# Altium schematic sheet ESC.SchDoc
size A3; PageSetup: Record=PageOptions|CenterHorizontal=True|CenterVertical=True|PrintScale=0.34|XCorrection=1.00|YCorrection=1.00|PrintKind=1|BorderSize=5000000|LeftOffset=0|BottomOffset=0|Orientation=2|PaperLength=1000|PaperWidth=1000|Scale=100|PaperSource=7|PrintQuality=-3|MediaType=1|DitherType=10|PrintScaleMode=1|PaperKind=A3|PaperIndex=8
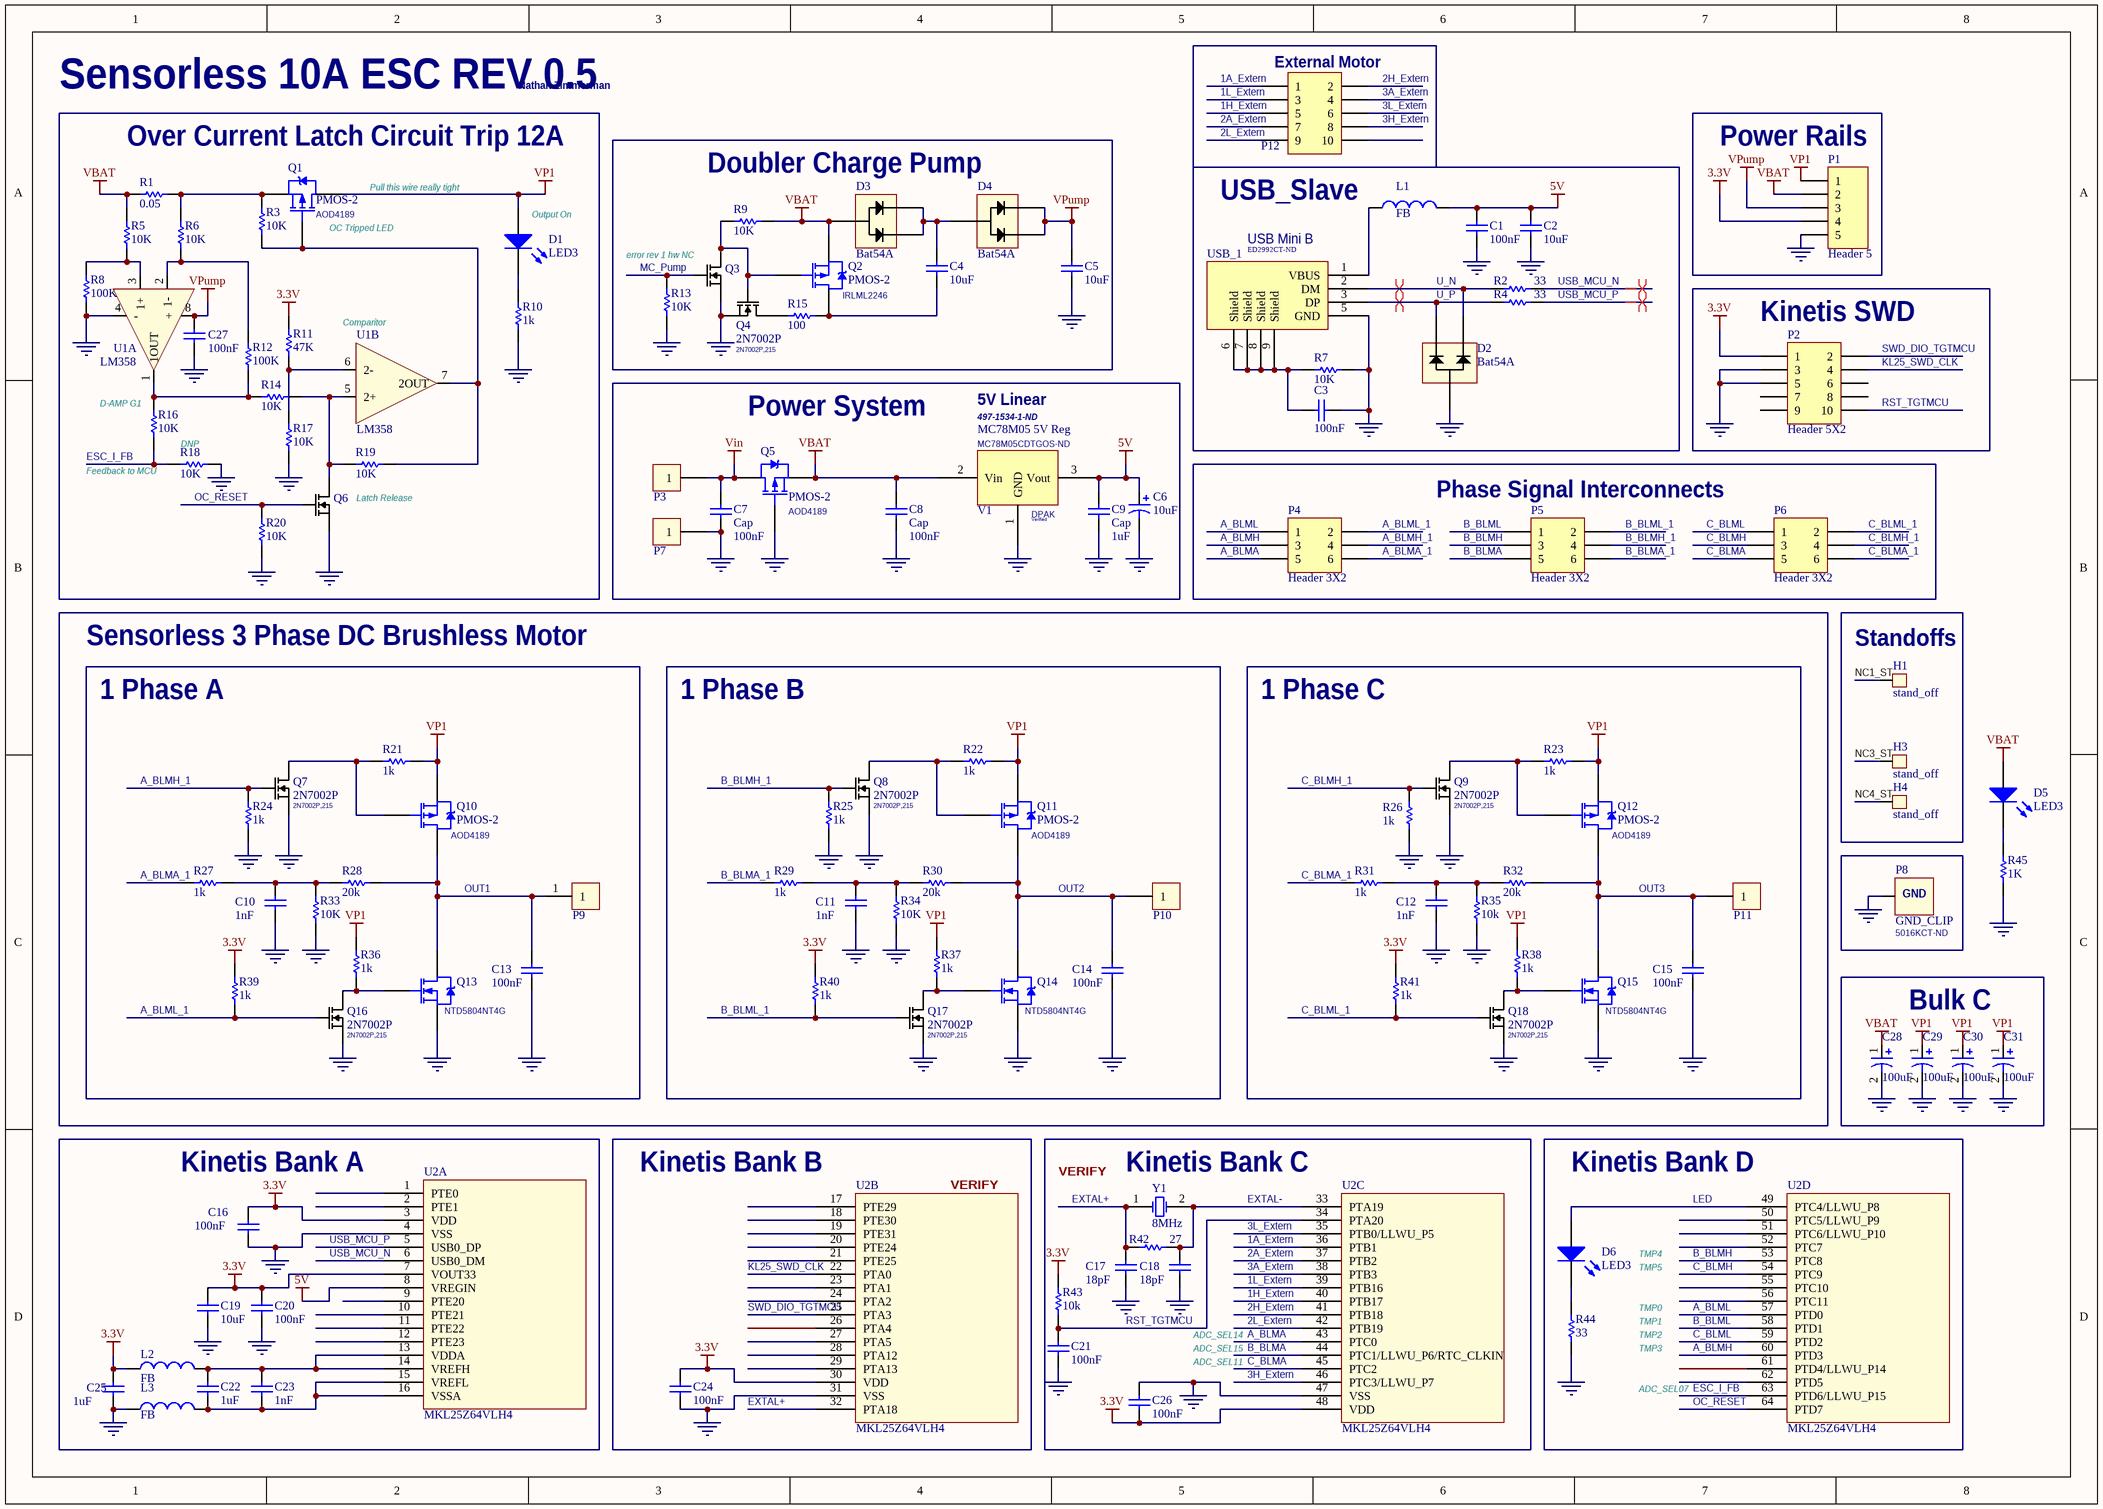
[diagram p0: ESC.SchDoc]

## Parts
C1  value 100nF  [1608[0603]]  (hidden comment: 0805)
C2  value 10uF  [C0805]  (hidden comment: 0805)
C3  value 100nF  [1608[0603]]  (hidden comment: 0805)
C4  value 10uF  [C0805]  (hidden comment: 0805)
C5  value 10uF  [C0805]  (hidden comment: 0805)
C6  value 10uF  [1206_C]  (hidden comment: Cap Pol1)
C7  Cap  value 100nF  [C0805]
C8  Cap  value 100nF  [C0805]
C9  Cap  value 1uF  [C0805]
C10  value 1nF  [1608[0603]]  (hidden comment: 0805)
C11  value 1nF  [1608[0603]]  (hidden comment: 0805)
C12  value 1nF  [1608[0603]]  (hidden comment: 0805)
C13  value 100nF  [1608[0603]]  (hidden comment: 0805)
C14  value 100nF  [1608[0603]]  (hidden comment: 0805)
C15  value 100nF  [1608[0603]]  (hidden comment: 0805)
C16  value 100nF  [1608[0603]]  (hidden comment: 0805)
C17  value 18pF  [1608[0603]]  (hidden comment: 0805)
C18  value 18pF  [1608[0603]]  (hidden comment: 0805)
C19  value 10uF  [C0805]  (hidden comment: 0805)
C20  value 100nF  [1608[0603]]  (hidden comment: 0805)
C21  value 100nF  [1608[0603]]  (hidden comment: 0805)
C22  value 1uF  [1608[0603]]  (hidden comment: 0805)
C23  value 1nF  [1608[0603]]  (hidden comment: 0805)
C24  value 100nF  [1608[0603]]  (hidden comment: 0805)
C25  value 1uF  [1608[0603]]  (hidden comment: 0805)
C26  value 100nF  [1608[0603]]  (hidden comment: 0805)
C27  value 100nF  [1608[0603]]  (hidden comment: 0805)
C28  value 100uF  [ELE_CAP]  (hidden comment: Cap Pol1)
C29  value 100uF  [ELE_CAP]  (hidden comment: Cap Pol1)
C30  value 100uF  [ELE_CAP]  (hidden comment: Cap Pol1)
C31  value 100uF  [ELE_CAP]  (hidden comment: Cap Pol1)
D1  LED3  [6-0805_L]
D2  Bat54A  [SOT-23B_N]
D3  Bat54A  [SOT-23B_N]
D4  Bat54A  [SOT-23B_N]
D5  LED3  [6-0805_L]
D6  LED3  [6-0805_L]
H1  stand_off  [4-40_screw_hole]
H3  stand_off  [4-40_screw_hole]
H4  stand_off  [4-40_screw_hole]
L1  FB  [1608[0603]]
L2  FB  [1608[0603]]
L3  FB  [1608[0603]]
P1  Header 5  [HDR1X5]
P2  Header 5X2  [MHDR2X5]
P3  Header  [8191_K]  (value not drawn)
P4  Header 3X2  [HDR2X3]
P5  Header 3X2  [HDR2X3]
P6  Header 3X2  [HDR2X3]
P7  Header  [8191_K]  (value not drawn)
P8  GND_CLIP  [GND_CLIP]
P9  Header  [8191_K]  (value not drawn)
P10  Header  [8191_K]  (value not drawn)
P11  Header  [8191_K]  (value not drawn)
P12  Header 5X2  [HDR2X5]  (value not drawn)
Q1  PMOS-2  [TO228P970-3_4AM]
Q2  PMOS-2  [SOT-23_M]
Q3  2N7002P  [SOT-23_M]  (value not drawn)
Q4  2N7002P  [SOT-23_M]
Q5  PMOS-2  [TO228P970-3_4AM]
Q6  2N7002P  [SOT-23_M]  (value not drawn)
Q7  2N7002P  [SOT-23_M]
Q8  2N7002P  [SOT-23_M]
Q9  2N7002P  [SOT-23_M]
Q10  PMOS-2  [TO228P970-3_4AM]
Q11  PMOS-2  [TO228P970-3_4AM]
Q12  PMOS-2  [TO228P970-3_4AM]
Q13  NMOS-2  [TO228P970-3_4AM]  (value not drawn)
Q14  NMOS-2  [TO228P970-3_4AM]  (value not drawn)
Q15  NMOS-2  [TO228P970-3_4AM]  (value not drawn)
Q16  2N7002P  [SOT-23_M]
Q17  2N7002P  [SOT-23_M]
Q18  2N7002P  [SOT-23_M]
R1  value 0.05  [RESC6432AM]  (hidden comment: Res1)
R2  value 33  [1608[0603]]  (hidden comment: Res1)
R3  value 10K  [1608[0603]]  (hidden comment: Res1)
R4  value 33  [1608[0603]]  (hidden comment: Res1)
R5  value 10K  [1608[0603]]  (hidden comment: Res1)
R6  value 10K  [1608[0603]]  (hidden comment: Res1)
R7  value 10K  [1608[0603]]  (hidden comment: Res1)
R8  value 100K  [1608[0603]]  (hidden comment: Res1)
R9  value 10K  [1608[0603]]  (hidden comment: Res1)
R10  value 1k  [1608[0603]]  (hidden comment: Res1)
R11  value 47K  [1608[0603]]  (hidden comment: Res1)
R12  value 100K  [1608[0603]]  (hidden comment: Res1)
R13  value 10K  [1608[0603]]  (hidden comment: Res1)
R14  value 10K  [1608[0603]]  (hidden comment: Res1)
R15  value 100  [1608[0603]]  (hidden comment: Res1)
R16  value 10K  [1608[0603]]  (hidden comment: Res1)
R17  value 10K  [1608[0603]]  (hidden comment: Res1)
R18  value 10K  [1608[0603]]  (hidden comment: Res1)
R19  value 10K  [1608[0603]]  (hidden comment: Res1)
R20  value 10K  [1608[0603]]  (hidden comment: Res1)
R21  value 1k  [1608[0603]]  (hidden comment: Res1)
R22  value 1k  [1608[0603]]  (hidden comment: Res1)
R23  value 1k  [1608[0603]]  (hidden comment: Res1)
R24  value 1k  [1608[0603]]  (hidden comment: Res1)
R25  value 1k  [1608[0603]]  (hidden comment: Res1)
R26  value 1k  [1608[0603]]  (hidden comment: Res1)
R27  value 1k  [1608[0603]]  (hidden comment: Res1)
R28  value 20k  [1608[0603]]  (hidden comment: Res1)
R29  value 1k  [1608[0603]]  (hidden comment: Res1)
R30  value 20k  [1608[0603]]  (hidden comment: Res1)
R31  value 1k  [1608[0603]]  (hidden comment: Res1)
R32  value 20k  [1608[0603]]  (hidden comment: Res1)
R33  value 10K  [1608[0603]]  (hidden comment: Res1)
R34  value 10K  [1608[0603]]  (hidden comment: Res1)
R35  value 10k  [1608[0603]]  (hidden comment: Res1)
R36  value 1k  [1608[0603]]  (hidden comment: Res1)
R37  value 1k  [1608[0603]]  (hidden comment: Res1)
R38  value 1k  [1608[0603]]  (hidden comment: Res1)
R39  value 1k  [1608[0603]]  (hidden comment: Res1)
R40  value 1k  [1608[0603]]  (hidden comment: Res1)
R41  value 1k  [1608[0603]]  (hidden comment: Res1)
R42  value 27  [1608[0603]]  (hidden comment: Res1)
R43  value 10k  [1608[0603]]  (hidden comment: Res1)
R44  value 33  [1608[0603]]  (hidden comment: Res1)
R45  value 1K  [1608[0603]]  (hidden comment: Res1)
U1  LM358  [SOIC127P600-8BM]  (parts A,B of 2)
U2  MKL25Z64VLH4  [TSQFP50P1200X1200-64M]  (parts A,B,C,D of 4)
USB_1  Digikey: ED2992CT-ND  [USB-M2xFxx]  (hidden comment: USB-M2xFxx)
V1  MC78M05 5V Reg  [TO228P970-3_4AM]
Y1  8MHz  [crystal]

## Blocks framed on the sheet
External Motor: P12
Sensorless 10A ESC REV 0.5: C27 D1 Q1 Q6 R1 R3 R5 R6 R8 R10-R12 R14 R16-R20 U1
Power Rails: P1
Doubler Charge Pump: C4 C5 D3 D4 Q2-Q4 R9 R13 R15
USB_Slave: C1-C3 D2 L1 R2 R4 R7 USB_1
Kinetis SWD: P2
Power System: C6-C9 P3 P7 Q5 V1
Phase Signal Interconnects: P4-P6
1 Phase B: C11 C14 P10 Q8 Q11 Q14 Q17 R22 R25 R29 R30 R34 R37 R40
1 Phase C: C12 C15 P11 Q9 Q12 Q15 Q18 R23 R26 R31 R32 R35 R38 R41
Standoffs: H1 H3 H4
Bulk C: C28-C31
Kinetis Bank A: C16 C19 C20 C22 C23 C25 L2 L3 U2
Kinetis Bank B: C24 U2
Kinetis Bank C: C17 C18 C21 C26 R42 R43 U2 Y1
Kinetis Bank D: D6 R44 U2

## Nets
3.3V: C16.2 C19.1 C20.1 C24.2 C25.2 C26.1 L2.2 P1.4 P2.1 R11.1 R39.1 R40.1 R41.1 R43.2 U2.3(VDD) U2.7(VOUT33) U2.30(VDD) U2.48(VDD)
5V: C1.1 C2.1 C6.1 C9.2 L1.1 U2.8(VREGIN) V1.3(Vout)
GND: C1.2 C2.2 C3.2 C5.2 C6.2 C7.1 C8.1 C9.1 C10.1 C11.1 C12.1 C13.1 C14.1 C15.1 C16.1 C17.1 C18.1 C19.2 C20.2 C21.1 C24.1 C25.1 C26.2 C27.1 C28.2 C29.2 C30.2 C31.2 D2.3 L3.2 P1.5 P2.3 P2.5 P7.1 P8.1(GND) Q3.2(S) Q4.2(S) Q5.1(G) Q6.2(S) Q7.2(S) Q8.2(S) Q9.2(S) Q13.3(S) Q14.3(S) Q15.3(S) Q16.2(S) Q17.2(S) Q18.2(S) R7.1 R8.1 R10.2 R13.2 R17.2 R18.1 R20.2 R24.2 R25.2 R26.2 R33.2 R34.2 R35.2 R44.2 R45.2 U1.4(-) U2.4(VSS) U2.31(VSS) U2.47(VSS) USB_1.5(GND) V1.1(GND)
VBAT: C8.2 C28.1 D3.3 D5.1(A) P1.2 Q2.2(S) Q5.3(S) R1.1 R5.1 R9.1 V1.2(Vin)
Vin: C7.2 P3.1 Q5.4(D)
VP1: C29.1 C30.1 C31.1 D1.1(A) P1.1 Q1.4(D) Q10.3(S) Q11.3(S) Q12.3(S) R21.1 R22.1 R23.1 R36.1 R37.1 R38.1
VPump: C5.1 C27.2 D4.1 D4.2 P1.3 U1.8(+)
1A_Extern: P12.1 U2.36(PTB1)
1H_Extern: P12.5 U2.40(PTB17)
1L_Extern: P12.3 U2.39(PTB16)
2A_Extern: P12.7 U2.37(PTB2)
2H_Extern: P12.2 U2.41(PTB18)
2L_Extern: P12.9 U2.42(PTB19)
3A_Extern: P12.4 U2.38(PTB3)
3H_Extern: P12.8 U2.46(PTC3/LLWU_P7)
3L_Extern: P12.6 U2.35(PTB0/LLWU_P5)
A_BLMA: P4.5 U2.43(PTC0)
A_BLMA_1: P4.6 R27.2
A_BLMH: P4.3 U2.60(PTD3)
A_BLMH_1: P4.4 Q7.1(G) R24.1
A_BLML: P4.1 U2.57(PTD0)
A_BLML_1: P4.2 Q16.1(G) R39.2
B_BLMA: P5.5 U2.44(PTC1/LLWU_P6/RTC_CLKIN)
B_BLMA_1: P5.6 R29.2
B_BLMH: P5.3 U2.53(PTC8)
B_BLMH_1: P5.4 Q8.1(G) R25.1
B_BLML: P5.1 U2.58(PTD1)
B_BLML_1: P5.2 Q17.1(G) R40.2
C_BLMA: P6.5 U2.45(PTC2)
C_BLMA_1: P6.6 R31.2
C_BLMH: P6.3 U2.54(PTC9)
C_BLMH_1: P6.4 Q9.1(G) R26.1
C_BLML: P6.1 U2.59(PTD2)
C_BLML_1: P6.2 Q18.1(G) R41.2
ESC_I_FB: R16.1 R18.2 U2.63(PTD6/LLWU_P15)
EXTAL+: C17.2 R42.1 U2.32(PTA18) Y1.1(OSC1)
EXTAL-: C18.2 R42.2 U2.33(PTA19) Y1.2(OSC2)
KL25_SWD_CLK: P2.4 U2.22(PTA0)
LED: D6.1(A) U2.49(PTC4/LLWU_P8)
MC_Pump: Q3.1(G) R13.1
NC1_ST: H1.1
NC3_ST: H3.1
NC4_ST: H4.1
OC_RESET: Q6.1(G) R20.1 U2.64(PTD7)
OUT1: C13.2 P9.1 Q10.4(D) Q13.4(D) R28.1
OUT2: C14.2 P10.1 Q11.4(D) Q14.4(D) R30.1
OUT3: C15.2 P11.1 Q12.4(D) Q15.4(D) R32.1
RST_TGTMCU: C21.2 P2.10 R43.1 U2.34(PTA20)
SWD_DIO_TGTMCU: P2.2 U2.25(PTA3)
U_N: D2.1 R2.1 USB_1.2(DM)
U_P: D2.2 R4.1 USB_1.3(DP)
USB_MCU_N: R2.2 U2.6(USB0_DM)
USB_MCU_P: R4.2 U2.5(USB0_DP)
NetC3_1: C3.1 R7.2 USB_1.6(Shield) USB_1.7(Shield) USB_1.8(Shield) USB_1.9(Shield)
NetC4_1: C4.1 D3.1 D3.2 D4.3
NetC4_2: C4.2 Q2.3(D) R15.1
NetC10_2: C10.2 R27.1 R28.2 R33.1
NetC11_2: C11.2 R29.1 R30.2 R34.1
NetC12_2: C12.2 R31.1 R32.2 R35.1
NetC22_1: C22.1 C23.1 L3.1 U2.15(VREFL) U2.16(VSSA)
NetC22_2: C22.2 C23.2 L2.1 U2.13(VDDA) U2.14(VREFH)
NetD1_2: D1.2(K) R10.1
NetD5_2: D5.2(K) R45.1
NetD6_2: D6.2(K) R44.1
NetL1_2: L1.2 USB_1.1(VBUS)
NetQ1_1: Q1.1(G) R3.2 R19.2 U1.7(2OUT)
NetQ1_3: Q1.3(S) R1.2 R3.1 R6.2
NetQ2_1: Q2.1(G) Q3.3(D) Q4.1(G) R9.2
NetQ4_3: Q4.3(D) R15.2
NetQ6_3: Q6.3(D) R14.2 R19.1 U1.5(2+)
NetQ7_3: Q7.3(D) Q10.1(G) R21.2
NetQ8_3: Q8.3(D) Q11.1(G) R22.2
NetQ9_3: Q9.3(D) Q12.1(G) R23.2
NetQ13_1: Q13.1(G) Q16.3(D) R36.2
NetQ14_1: Q14.1(G) Q17.3(D) R37.2
NetQ15_1: Q15.1(G) Q18.3(D) R38.2
NetR5_2: R5.2 R8.2 U1.3(1+)
NetR6_1: R6.1 R12.2 U1.2(1-)
NetR11_2: R11.2 R17.1 U1.6(2-)
NetR12_1: R12.1 R14.1 R16.2 U1.1(1OUT)

Not connected (* = marked no-connect by the designer): P2 6 7 8 9; P12 10; U2 1(PTE0) 2(PTE1) 9(PTE20) 10(PTE21) 11(PTE22) 12(PTE23) 17(PTE29) 18(PTE30) 19(PTE31) 20(PTE24) 21(PTE25) 23(PTA1) 24(PTA2) 26(PTA4) 27(PTA5) 28(PTA12) 29(PTA13) 50(PTC5/LLWU_P9) 51(PTC6/LLWU_P10) 52(PTC7) 55(PTC10) 56(PTC11) 61(PTD4/LLWU_P14) 62(PTD5); USB_1 4(NC)

## Layout directives
differential pair: U_N, U_P, USB_MCU_N, USB_MCU_P

## Notes on the sheet
- Nathan Zimmerman
- Over Current Latch Circuit Trip 12A
- (near Q1) OC Tripped LED
- Pull this wire really tight
- (near D1) Output On
- (near USB_1) USB Mini B
- (near Q3) error rev 1 hw NC
- Comparitor
- (near R16) D-AMP G1
- (near R18) DNP
- (near V1) MC78M05CDTGOS-ND
- 5V Linear
- Feedback to MCU
- Latch Release
- (near V1) DPAK
- (near V1) Verified
- Sensorless 3 Phase DC Brushless Motor
- 1 Phase A
- VERIFY
- TMP4
- TMP0
- TMP1
- TMP5
- ADC_SEL14
- ADC_SEL15
- ADC_SEL11
- TMP2
- TMP3
- ADC_SEL07
- (in symbol 2N7002P) 2N7002P,215
- (in symbol GND_CLIP) 5016KCT-ND
- (in symbol MCP1702) 497-1534-1-ND
- (in symbol NMOS-2) NTD5804NT4G
- (in symbol PMOS-2) IRLML2246; AOD4189

## Library data of the parts
C1-C5 C10-C27 = Cap Semi: Capacitor (Semiconductor SIM Model)
  C1-C5 C10-C26: Published: 8-Jun-2000; LatestRevisionDate: 29-May-2009; LatestRevisionNote: IPC-7351 Footprint Added.; PackageReference: C1206; Publisher: Altium Limited; PackageDescription: Chip Capacitor; Digikey: 311-1361-1-ND
C6 C28-C31 = Cap Pol1: Polarized Capacitor (Radial)
C7-C9 = Cap: Capacitor; Published: 8-Jun-2000; LatestRevisionDate: 17-Jul-2002; LatestRevisionNote: Re-released for DXP Platform.; PackageReference: RAD-0.3; Publisher: Altium Limited; PackageDescription: Radial Cap, Thru-Hole; 2 Leads; 0.3 in Pin Spacing
D1 D5 D6 = LED3: Typical BLUE SiC LED; Published: 8-Jun-2000; LatestRevisionDate: 17-Dec-2003; LatestRevisionNote: PCB Footprint replaced.; DatasheetVersion: 16-Apr-2002; PackageVersion: 16-Apr-2002; PackageReference: 3.5X2.8X1.9; Publisher: Altium Limited; PackageDescription: SM LED; 2 C-Bend Leads; Body 3.5 x 2.8 x 1.9 mm, inc leads (LxWxH typ)
D2-D4 = Bat45C
L1-L3 = Inductor
P1 = Header 5: Header, 5-Pin; LatestRevisionDate: 17-Jul-2002; LatestRevisionNote: Re-released for DXP Platform.; Publisher: Altium Limited
P2 P12 = Header 5X2: Header, 5-Pin, Dual row; LatestRevisionDate: 17-Jul-2002; LatestRevisionNote: Re-released for DXP Platform.; Publisher: Altium Limited
P3 P7 P9-P11 = Header1h1
P4-P6 = Header 3X2: Header, 3-Pin, Dual row; LatestRevisionDate: 17-Jul-2002; LatestRevisionNote: Re-released for DXP Platform.; Publisher: Altium Limited
Q1 Q2 Q5 Q10-Q12 = PMOS-2: P-Channel Power MOSFET
Q13-Q15 = NMOS-2: N-Channel Power MOSFET
R1-R45 = Res1: Resistor; Published: 8-Jun-2000; LatestRevisionDate: 17-Jul-2002; LatestRevisionNote: Re-released for DXP Platform.; PackageReference: AXIAL-0.3; Publisher: Altium Limited; PackageDescription: Axial Device, Thru-Hole; 2 Leads; 0.3 in Pin Spacing
U1 = LM358: LM358 Op Amp
U2 = MKL25Z64VLH4: MKL25Z64VLH4 MCU
USB_1 = USB-M2xFxx: USB Mini-B for USB-M2xFxx
V1 = MCP1702: MCP1702 5V REG; pin to pad: 1>4 2>1
Y1 = XTAL: Crystal Oscillator